# Altium schematic sheet Speaker.SchDoc
size A4
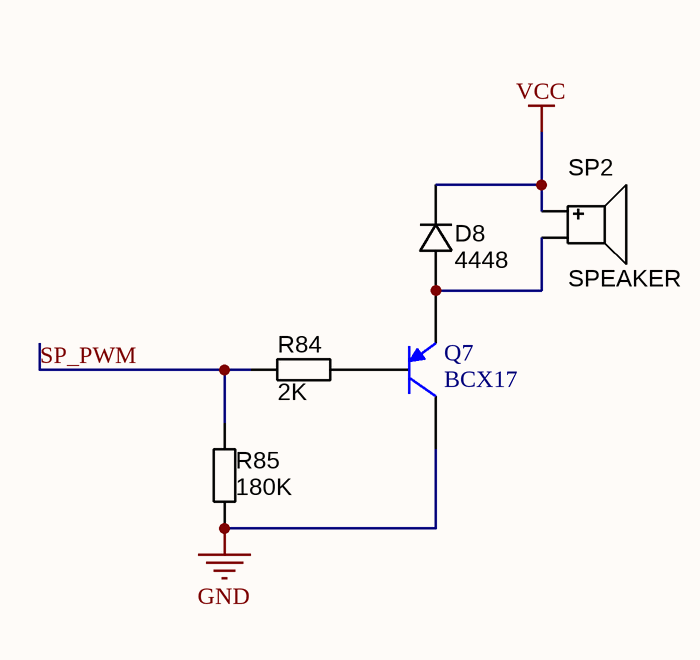
[diagram p0: Speaker.SchDoc]

## Parts
D8  4448  [SOD523F]
Q7  BCX17  [SOT23-3N]
R84  2K  [RESC1005L]
R85  180K  [RESC1005L]
SP2  Manufacturer Part Number 1: SPEAKER  [BUZZER_12.0X8.5MM]  (hidden comment: Alternate part: 3100-932)

## Nets
GND: Q7.3(C) R85.1
VCC: D8.K SP2.1(Positive)
SP_PWM: R84.1 R85.2
NetD8_A: D8.A Q7.2(E) SP2.2(Negative)
NetQ7_1: Q7.1(B) R84.2

## Notes on the sheet
- Title
- Name
- Size:
- Revision:
- A3
- Date:
- Time:
- Sheet
- of

## Library data of the parts
D8 = DIODE_1N4148_200mA_SOD523F: Diode SMD small signal 0.2A SOD-523F; Ratings: Vr=75V; Vf=1V@10mA; Io=200mA; Material: Si; Package / Case: SC-79, SOD-523F; Supplier 1: Digi-Key; Supplier Part Number 1: 1N4148WTCT-ND; Value: 4448
Q7 = BCX17: PNP General Purpose Transistors; Published: 8-Jun-2000; LatestRevisionDate: 15-Jan-2003; LatestRevisionNote: PCB Footprint 'BCY-W3/D4.7' replaced; DatasheetVersion: 1997; PackageVersion: Sep-1998; PackageReference: TO-92A; Publisher: Altium Limited; PackageDescription: TO, Flat Index; 3 In-Line, Axial Leads; Body Dia. 4.5mm; Leads 0.51 x 0.48 mm (max); ComponentLink1Description: Manufacturer Link; ComponentLink1URL: http://www.fairchildsemi.com/; ComponentLink2Description: Datasheet; ComponentLink2URL: http://www.fairchildsemi.com/ds/2N%2F2N3906.pdf
R84 = RES_10K_0805_5%: Resistor SMD chip; Manufacturer 1: Yageo; Manufacturer Part Number 1: RC0805JR-0710KL; Ratings: 1/8 W; Tolerance: ?%; Package / Case: 0805 (2012 metric); Material: Thick Film; Supplier 1: Digi-Key; Supplier Part Number 1: 311-10KARCT-ND; Value: 2K
R85 = RES_330R_0402_5%: Resistor SMD chip; Manufacturer 1: Yageo; Manufacturer Part Number 1: RC0402JR-07330RL; Ratings: 1/16 W; Tolerance: ?%; Package / Case: 0402 (1005 Metric); Supplier 1: Digi-Key; Supplier Part Number 1: 311-330JRCT-ND; ComponentLink1URL: http://www.yageo.com/documents/recent/PYu-RC0402_51_RoHS_L_6.pdf; ComponentLink1Description: http://www.yageo.com/documents/recent/PYu-RC0402_51_RoHS_L_6.pdf; Value: 180K
SP2 = BZ_12x8.5x6.5_2kHz: Speaker, Magnetic Transducer; Manufacturer 1: CUI Inc; Ratings: 2048 ?00 Hz; Package / Case: 6.5mm pitch; Material: Noryl SE1-J; Supplier 1: Digi-Key; Supplier Part Number 1: 102-1152-ND